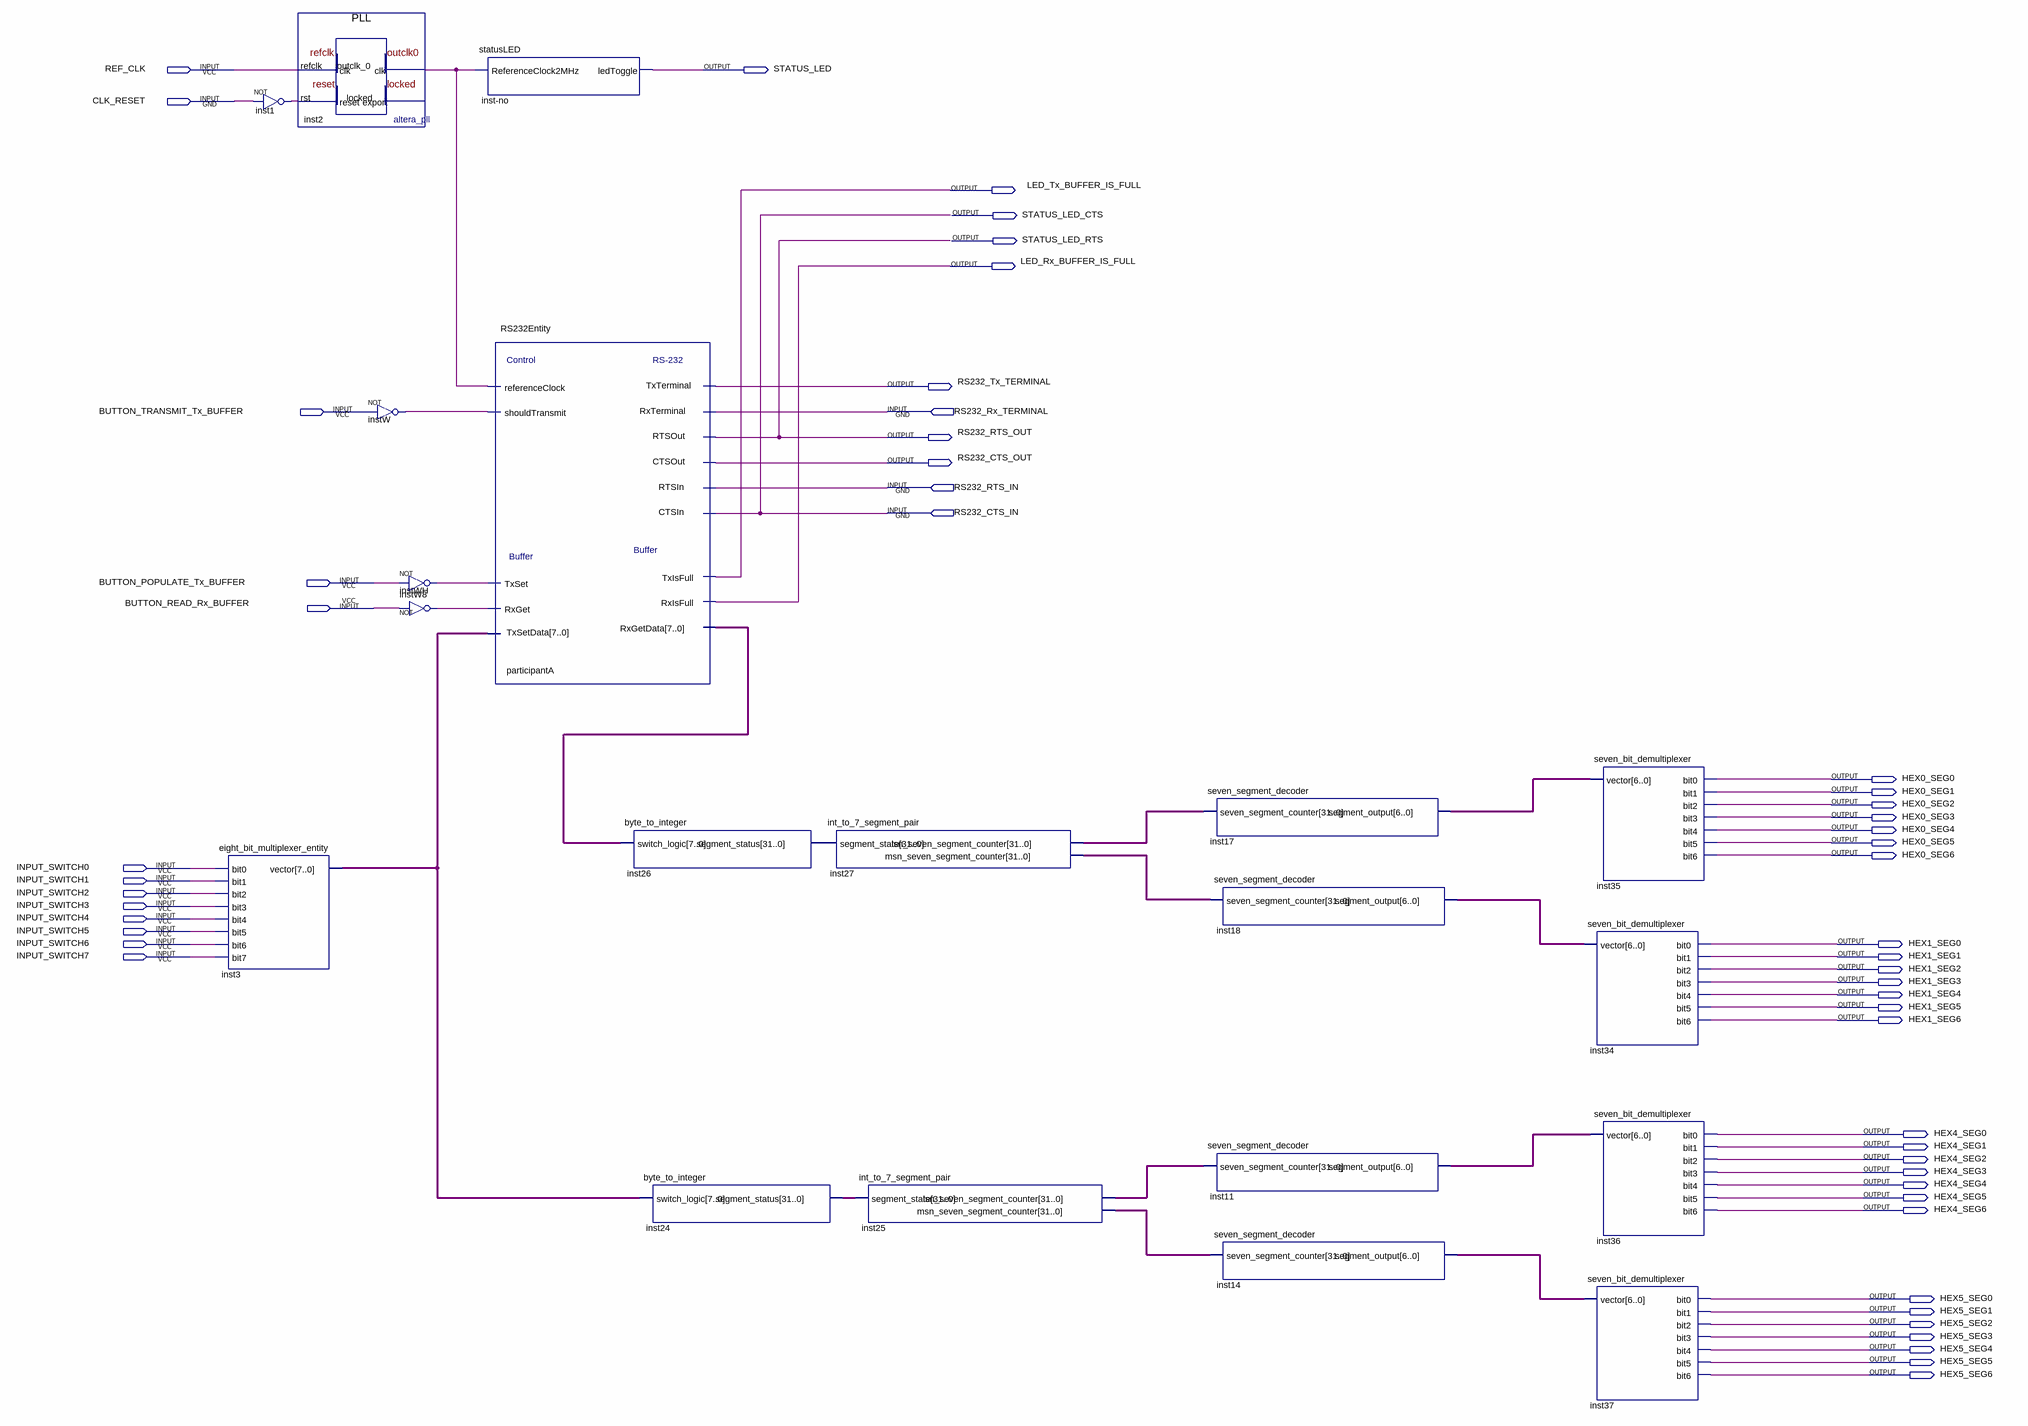
[diagram p0: schematic sheet]
// Quartus schematic project5-RS232.bdf as structural Verilog: 20 symbols, 52 pins
module \project5-RS232  (
  input  REF_CLK,
  input  CLK_RESET,
  input  BUTTON_TRANSMIT_Tx_BUFFER,
  input  RS232_Rx_TERMINAL,
  input  RS232_RTS_IN,
  input  RS232_CTS_IN,
  input  BUTTON_POPULATE_Tx_BUFFER,
  input  BUTTON_READ_Rx_BUFFER,
  input  INPUT_SWITCH0,
  input  INPUT_SWITCH1,
  input  INPUT_SWITCH2,
  input  INPUT_SWITCH3,
  input  INPUT_SWITCH4,
  input  INPUT_SWITCH5,
  input  INPUT_SWITCH6,
  input  INPUT_SWITCH7,
  output STATUS_LED,
  output LED_Tx_BUFFER_IS_FULL,
  output STATUS_LED_CTS,
  output STATUS_LED_RTS,
  output LED_Rx_BUFFER_IS_FULL,
  output RS232_Tx_TERMINAL,
  output RS232_RTS_OUT,
  output RS232_CTS_OUT,
  output HEX0_SEG0,
  output HEX0_SEG1,
  output HEX0_SEG2,
  output HEX0_SEG3,
  output HEX0_SEG4,
  output HEX0_SEG5,
  output HEX0_SEG6,
  output HEX1_SEG0,
  output HEX1_SEG1,
  output HEX1_SEG2,
  output HEX1_SEG3,
  output HEX1_SEG4,
  output HEX1_SEG5,
  output HEX1_SEG6,
  output HEX4_SEG0,
  output HEX4_SEG1,
  output HEX4_SEG2,
  output HEX4_SEG3,
  output HEX4_SEG4,
  output HEX4_SEG5,
  output HEX4_SEG6,
  output HEX5_SEG0,
  output HEX5_SEG1,
  output HEX5_SEG2,
  output HEX5_SEG3,
  output HEX5_SEG4,
  output HEX5_SEG5,
  output HEX5_SEG6
);

  wire inst1_out, inst2_outclk_0, instW8_out, instW_out, instWH_out;
  wire [6:0] inst11_segment_output, inst14_segment_output, inst17_segment_output, inst18_segment_output;
  wire [7:0] inst3_vector, participantA_rxgetdata;
  wire [31:0] inst24_segment_status, inst25_lsn_seven_segment_counter, inst25_msn_seven_segment_counter,
       inst26_segment_status, inst27_lsn_seven_segment_counter, inst27_msn_seven_segment_counter;

  eight_bit_multiplexer_entity inst3 (
    .bit0(INPUT_SWITCH0), .bit1(INPUT_SWITCH1), .bit2(INPUT_SWITCH2), .bit3(INPUT_SWITCH3),
    .bit4(INPUT_SWITCH4), .bit5(INPUT_SWITCH5), .bit6(INPUT_SWITCH6), .bit7(INPUT_SWITCH7),
    .vector(inst3_vector));
  not inst1 (inst1_out, CLK_RESET);
  PLL inst2 (.refclk(REF_CLK), .rst(inst1_out), .outclk_0(inst2_outclk_0));  // open: locked
  not instW (instW_out, BUTTON_TRANSMIT_Tx_BUFFER);
  not instWH (instWH_out, BUTTON_POPULATE_Tx_BUFFER);
  not instW8 (instW8_out, BUTTON_READ_Rx_BUFFER);
  statusLED \inst-no  (.ReferenceClock2MHz(inst2_outclk_0), .ledToggle(STATUS_LED));
  RS232Entity participantA (
    .referenceClock(inst2_outclk_0), .shouldTransmit(instW_out), .RxTerminal(RS232_Rx_TERMINAL),
    .RTSIn(RS232_RTS_IN), .CTSIn(RS232_CTS_IN), .TxSet(instWH_out), .TxSetData(inst3_vector),
    .RxGet(instW8_out), .TxTerminal(RS232_Tx_TERMINAL), .RTSOut(RS232_RTS_OUT), .CTSOut(RS232_CTS_OUT),
    .TxIsFull(LED_Tx_BUFFER_IS_FULL), .RxGetData(participantA_rxgetdata), .RxIsFull(LED_Rx_BUFFER_IS_FULL));
  byte_to_integer inst26 (.switch_logic(participantA_rxgetdata), .segment_status(inst26_segment_status));
  byte_to_integer inst24 (.switch_logic(inst3_vector), .segment_status(inst24_segment_status));
  int_to_7_segment_pair inst27 (
    .segment_state(inst26_segment_status), .lsn_seven_segment_counter(inst27_lsn_seven_segment_counter),
    .msn_seven_segment_counter(inst27_msn_seven_segment_counter));
  int_to_7_segment_pair inst25 (
    .segment_state(inst24_segment_status), .lsn_seven_segment_counter(inst25_lsn_seven_segment_counter),
    .msn_seven_segment_counter(inst25_msn_seven_segment_counter));
  seven_segment_decoder inst17 (
    .seven_segment_counter(inst27_lsn_seven_segment_counter), .segment_output(inst17_segment_output));
  seven_segment_decoder inst18 (
    .seven_segment_counter(inst27_msn_seven_segment_counter), .segment_output(inst18_segment_output));
  seven_segment_decoder inst11 (
    .seven_segment_counter(inst25_lsn_seven_segment_counter), .segment_output(inst11_segment_output));
  seven_segment_decoder inst14 (
    .seven_segment_counter(inst25_msn_seven_segment_counter), .segment_output(inst14_segment_output));
  seven_bit_demultiplexer inst34 (
    .vector(inst18_segment_output), .bit0(HEX1_SEG0), .bit1(HEX1_SEG1), .bit2(HEX1_SEG2), .bit3(HEX1_SEG3),
    .bit4(HEX1_SEG4), .bit5(HEX1_SEG5), .bit6(HEX1_SEG6));
  seven_bit_demultiplexer inst37 (
    .vector(inst14_segment_output), .bit0(HEX5_SEG0), .bit1(HEX5_SEG1), .bit2(HEX5_SEG2), .bit3(HEX5_SEG3),
    .bit4(HEX5_SEG4), .bit5(HEX5_SEG5), .bit6(HEX5_SEG6));
  seven_bit_demultiplexer inst35 (
    .vector(inst17_segment_output), .bit0(HEX0_SEG0), .bit1(HEX0_SEG1), .bit2(HEX0_SEG2), .bit3(HEX0_SEG3),
    .bit4(HEX0_SEG4), .bit5(HEX0_SEG5), .bit6(HEX0_SEG6));
  seven_bit_demultiplexer inst36 (
    .vector(inst11_segment_output), .bit0(HEX4_SEG0), .bit1(HEX4_SEG1), .bit2(HEX4_SEG2), .bit3(HEX4_SEG3),
    .bit4(HEX4_SEG4), .bit5(HEX4_SEG5), .bit6(HEX4_SEG6));

  assign STATUS_LED_CTS = RS232_CTS_IN;
  assign STATUS_LED_RTS = RS232_RTS_OUT;
endmodule
